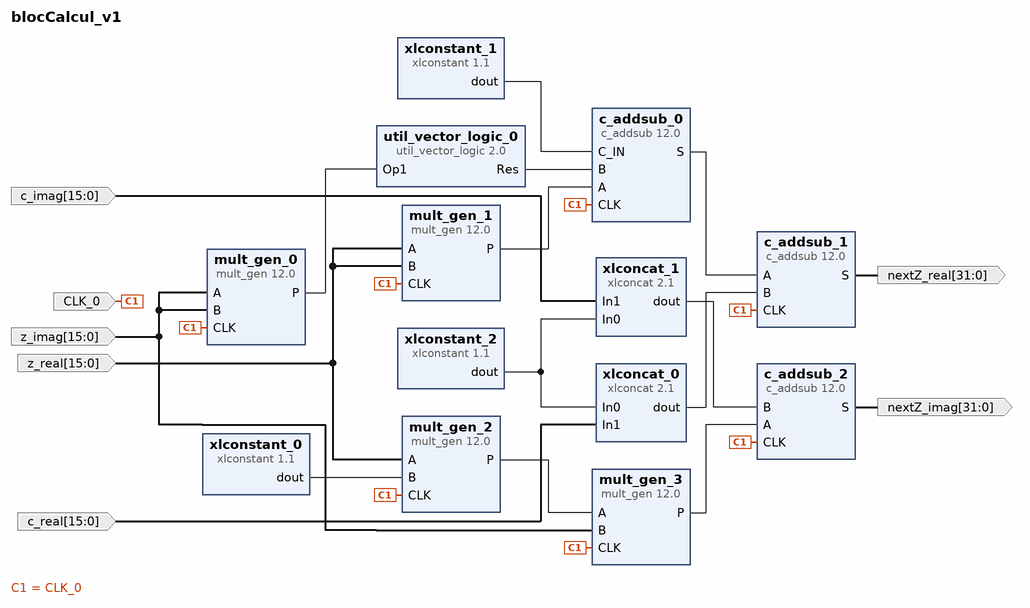
[diagram p0: block diagram of the top level]
# Vivado block design blocCalcul_v1, xc7a200tsbg484-1, Vivado 2021.2
create_bd_design blocCalcul_v1

create_bd_port -dir I -type clk CLK_0
set_property -dict {CONFIG.FREQ_HZ 10000000} [get_bd_ports CLK_0]
create_bd_port -dir O -from 31 -to 0 -type data nextZ_real
create_bd_port -dir O -from 31 -to 0 -type data nextZ_imag
create_bd_port -dir I -from 15 -to 0 c_imag
create_bd_port -dir I -from 15 -to 0 c_real
create_bd_port -dir I -from 15 -to 0 -type data z_real
create_bd_port -dir I -from 15 -to 0 -type data z_imag

create_bd_cell -type ip -vlnv xilinx.com:ip:mult_gen:12.0 mult_gen_0
set_property -dict {CONFIG.PortAWidth 16 CONFIG.PortBWidth 16} [get_bd_cells mult_gen_0]
create_bd_cell -type ip -vlnv xilinx.com:ip:mult_gen:12.0 mult_gen_1
set_property -dict {CONFIG.PortAWidth 16 CONFIG.PortBWidth 16} [get_bd_cells mult_gen_1]
create_bd_cell -type ip -vlnv xilinx.com:ip:c_addsub:12.0 c_addsub_0
set_property -dict [list \
  CONFIG.A_Width 32 \
  CONFIG.B_Value 00000000000000000000000000000000 \
  CONFIG.B_Width 32 \
  CONFIG.CE false \
  CONFIG.C_In true \
  CONFIG.Latency 1 \
  CONFIG.Out_Width 32 \
] [get_bd_cells c_addsub_0]
create_bd_cell -type ip -vlnv xilinx.com:ip:util_vector_logic:2.0 util_vector_logic_0
set_property -dict {CONFIG.C_OPERATION not CONFIG.C_SIZE 31} [get_bd_cells util_vector_logic_0]
create_bd_cell -type ip -vlnv xilinx.com:ip:c_addsub:12.0 c_addsub_1
set_property -dict [list \
  CONFIG.A_Width 32 \
  CONFIG.B_Value 00000000000000000000000000000000 \
  CONFIG.B_Width 32 \
  CONFIG.CE false \
  CONFIG.C_In false \
  CONFIG.Latency 1 \
  CONFIG.Out_Width 32 \
] [get_bd_cells c_addsub_1]
create_bd_cell -type ip -vlnv xilinx.com:ip:c_addsub:12.0 c_addsub_2
set_property -dict [list \
  CONFIG.A_Width 32 \
  CONFIG.B_Value 00000000000000000000000000000000 \
  CONFIG.B_Width 32 \
  CONFIG.CE false \
  CONFIG.C_In false \
  CONFIG.Latency 1 \
  CONFIG.Out_Width 32 \
] [get_bd_cells c_addsub_2]
create_bd_cell -type ip -vlnv xilinx.com:ip:mult_gen:12.0 mult_gen_2
set_property -dict [list \
  CONFIG.OutputWidthHigh 16 \
  CONFIG.PortAWidth 16 \
  CONFIG.PortBWidth 16 \
  CONFIG.Use_Custom_Output_Width true \
] [get_bd_cells mult_gen_2]
create_bd_cell -type ip -vlnv xilinx.com:ip:mult_gen:12.0 mult_gen_3
set_property -dict [list \
  CONFIG.OutputWidthHigh 31 \
  CONFIG.PortAWidth 17 \
  CONFIG.PortBWidth 16 \
  CONFIG.Use_Custom_Output_Width true \
] [get_bd_cells mult_gen_3]
create_bd_cell -type ip -vlnv xilinx.com:ip:xlconstant:1.1 xlconstant_0
set_property -dict {CONFIG.CONST_VAL 2 CONFIG.CONST_WIDTH 16} [get_bd_cells xlconstant_0]
create_bd_cell -type ip -vlnv xilinx.com:ip:xlconstant:1.1 xlconstant_1
set_property -dict {CONFIG.CONST_VAL 1 CONFIG.CONST_WIDTH 32} [get_bd_cells xlconstant_1]
create_bd_cell -type ip -vlnv xilinx.com:ip:xlconcat:2.1 xlconcat_0
set_property -dict {CONFIG.IN0_WIDTH 16 CONFIG.IN1_WIDTH 16} [get_bd_cells xlconcat_0]
create_bd_cell -type ip -vlnv xilinx.com:ip:xlconcat:2.1 xlconcat_1
set_property -dict {CONFIG.IN0_WIDTH 16 CONFIG.IN1_WIDTH 16} [get_bd_cells xlconcat_1]
create_bd_cell -type ip -vlnv xilinx.com:ip:xlconstant:1.1 xlconstant_2
set_property -dict {CONFIG.CONST_VAL 0 CONFIG.CONST_WIDTH 16} [get_bd_cells xlconstant_2]

# ---- connections ----

connect_bd_net -net A_0_2 [get_bd_ports z_real] [get_bd_pins mult_gen_1/A] [get_bd_pins mult_gen_1/B] [get_bd_pins mult_gen_2/A]
connect_bd_net -net CLK_0_1 [get_bd_ports CLK_0] \
  [get_bd_pins mult_gen_1/CLK] [get_bd_pins mult_gen_0/CLK] [get_bd_pins c_addsub_0/CLK] [get_bd_pins c_addsub_1/CLK] \
  [get_bd_pins mult_gen_3/CLK] [get_bd_pins mult_gen_2/CLK] [get_bd_pins c_addsub_2/CLK]
connect_bd_net -net In1_0_1 [get_bd_ports c_imag] [get_bd_pins xlconcat_1/In1]
connect_bd_net -net In1_1_1 [get_bd_ports c_real] [get_bd_pins xlconcat_0/In1]
connect_bd_net [get_bd_pins c_addsub_0/S] [get_bd_pins c_addsub_1/A]
connect_bd_net [get_bd_pins c_addsub_1/S] [get_bd_ports nextZ_real]
connect_bd_net [get_bd_pins c_addsub_2/S] [get_bd_ports nextZ_imag]
connect_bd_net [get_bd_pins mult_gen_0/P] [get_bd_pins util_vector_logic_0/Op1]
connect_bd_net [get_bd_pins mult_gen_1/P] [get_bd_pins c_addsub_0/A]
connect_bd_net [get_bd_pins mult_gen_2/P] [get_bd_pins mult_gen_3/A]
connect_bd_net [get_bd_pins mult_gen_3/P] [get_bd_pins c_addsub_2/A]
connect_bd_net [get_bd_pins util_vector_logic_0/Res] [get_bd_pins c_addsub_0/B]
connect_bd_net [get_bd_pins xlconcat_0/dout] [get_bd_pins c_addsub_1/B]
connect_bd_net [get_bd_pins xlconcat_1/dout] [get_bd_pins c_addsub_2/B]
connect_bd_net [get_bd_pins xlconstant_0/dout] [get_bd_pins mult_gen_2/B]
connect_bd_net [get_bd_pins xlconstant_1/dout] [get_bd_pins c_addsub_0/C_IN]
connect_bd_net [get_bd_pins xlconstant_2/dout] [get_bd_pins xlconcat_0/In0] [get_bd_pins xlconcat_1/In0]
connect_bd_net [get_bd_ports z_imag] [get_bd_pins mult_gen_3/B] [get_bd_pins mult_gen_0/B] [get_bd_pins mult_gen_0/A]

validate_bd_design
save_bd_design
